# EAGLE design lifi_1 (EAGLE 8.3.0)
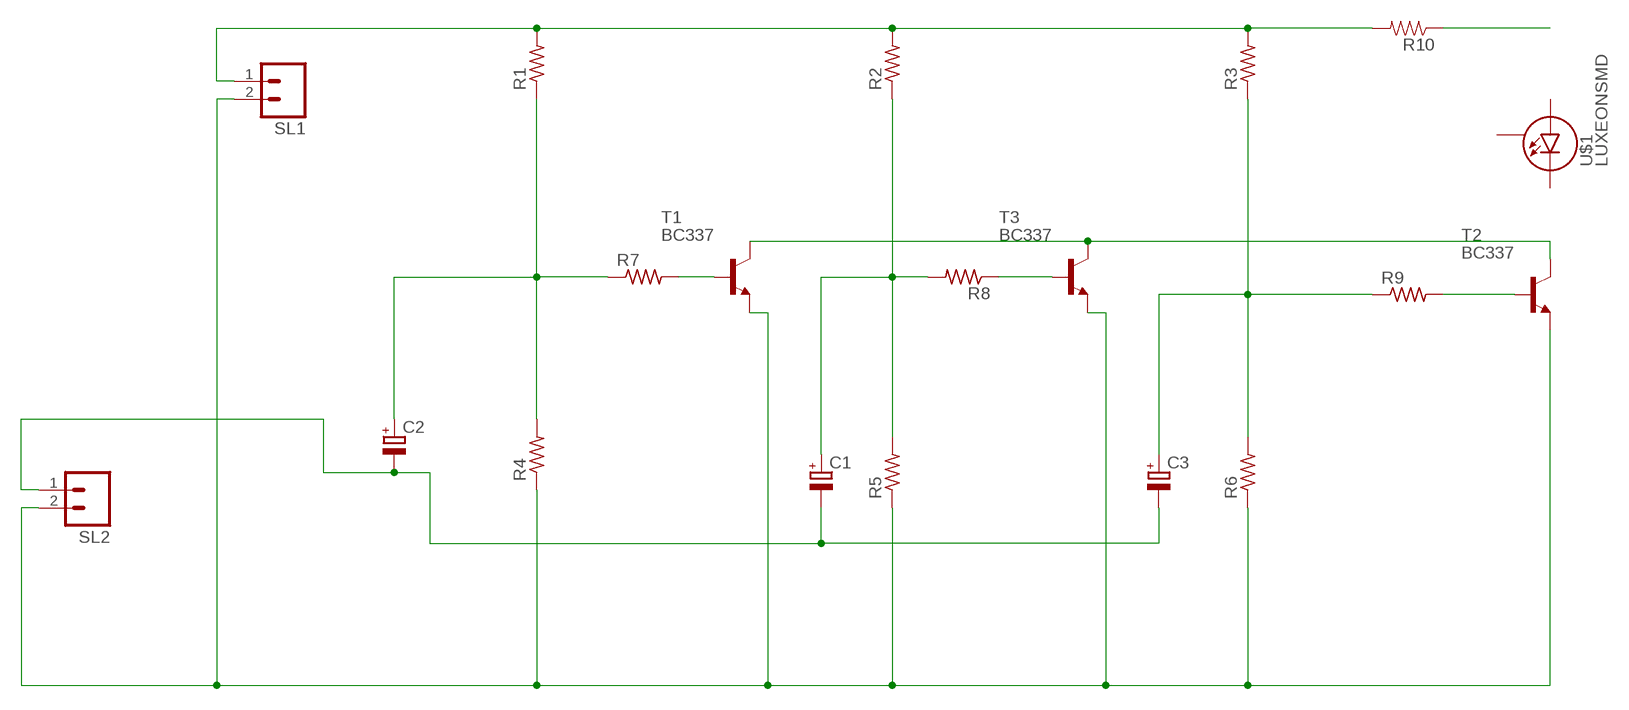
[diagram p0: schematic, sheet 1]

## Parts
C1  CPOL-EUE2,5-6E  [E2,5-6E]
C2  CPOL-EUE2,5-6E  [E2,5-6E]
C3  CPOL-EUE2,5-6E  [E2,5-6E]
R1  RESISTOR0207/7  [0207/7]
R2  RESISTOR0207/7  [0207/7]
R3  RESISTOR0207/7  [0207/7]
R4  RESISTOR0207/7  [0207/7]
R5  RESISTOR0207/7  [0207/7]
R6  RESISTOR0207/7  [0207/7]
R7  RESISTOR0207/7  [0207/7]
R8  RESISTOR0207/7  [0207/7]
R9  RESISTOR0207/7  [0207/7]
R10  RESISTORPTH-1W  [AXIAL-0.6]
SL1  M02  [02P]
SL2  M02  [02P]
T1  BC337  [TO92]
T2  BC337  [TO92]
T3  BC337  [TO92]
U$1  LUXEONSMD  [LUXEON]

## Nets
N$1: R10.P$1
N$2: R1.2 R2.2 R3.2 R10.P$2 SL1.1
N$3: C2.+ R1.1 R4.2 R7.1
N$4: R7.2 T1.2(B)
N$5: C1.+ R2.1 R5.2 R8.2
N$6: R8.1 T3.2(B)
N$9: C3.+ R3.1 R6.2 R9.1
N$11: R9.2 T2.2(B)
N$13: T1.3(C) T2.3(C) T3.3(C)
N$15: C1.- C2.- C3.- SL2.1
N$17: R4.1 R5.1 R6.1 SL1.2 SL2.2 T1.1(E) T2.1(E) T3.1(E)
Unconnected: U$1.A U$1.C U$1.S

## Library data of the parts
C1-C3 = assignment:CPOL-EU: POLARIZED CAPACITOR, European symbol
R1-R9 = CEDT_JANUARY_2015_v5:RESISTOR
R10 = SparkFun-Passives:RESISTOR: Resistor Basic schematic elements and footprints for 0603, 1206, and PTH resistors.
SL1 = CEDT_JANUARY_2015_v5:M02: AMP QUICK CONNECTOR
SL2 = con-amp-quick:M02: AMP QUICK CONNECTOR; OC_FARNELL: unknown; OC_NEWARK: unknown
T1-T3 = transistor:BC337: NPN TRANSISTOR
U$1 = SparkFun-LED:LUXEON: Luxeon LED This footprint works with the current 1 Watt, 3 Watt, and 5 Watt LEDs. These blindingly bright LEDs generate a lot of heat so the footprint has a large pad under the LED for thermal transfer. Schematic and footprint are proven. Spark Fun Electronics SKU : COM-00603

## Board
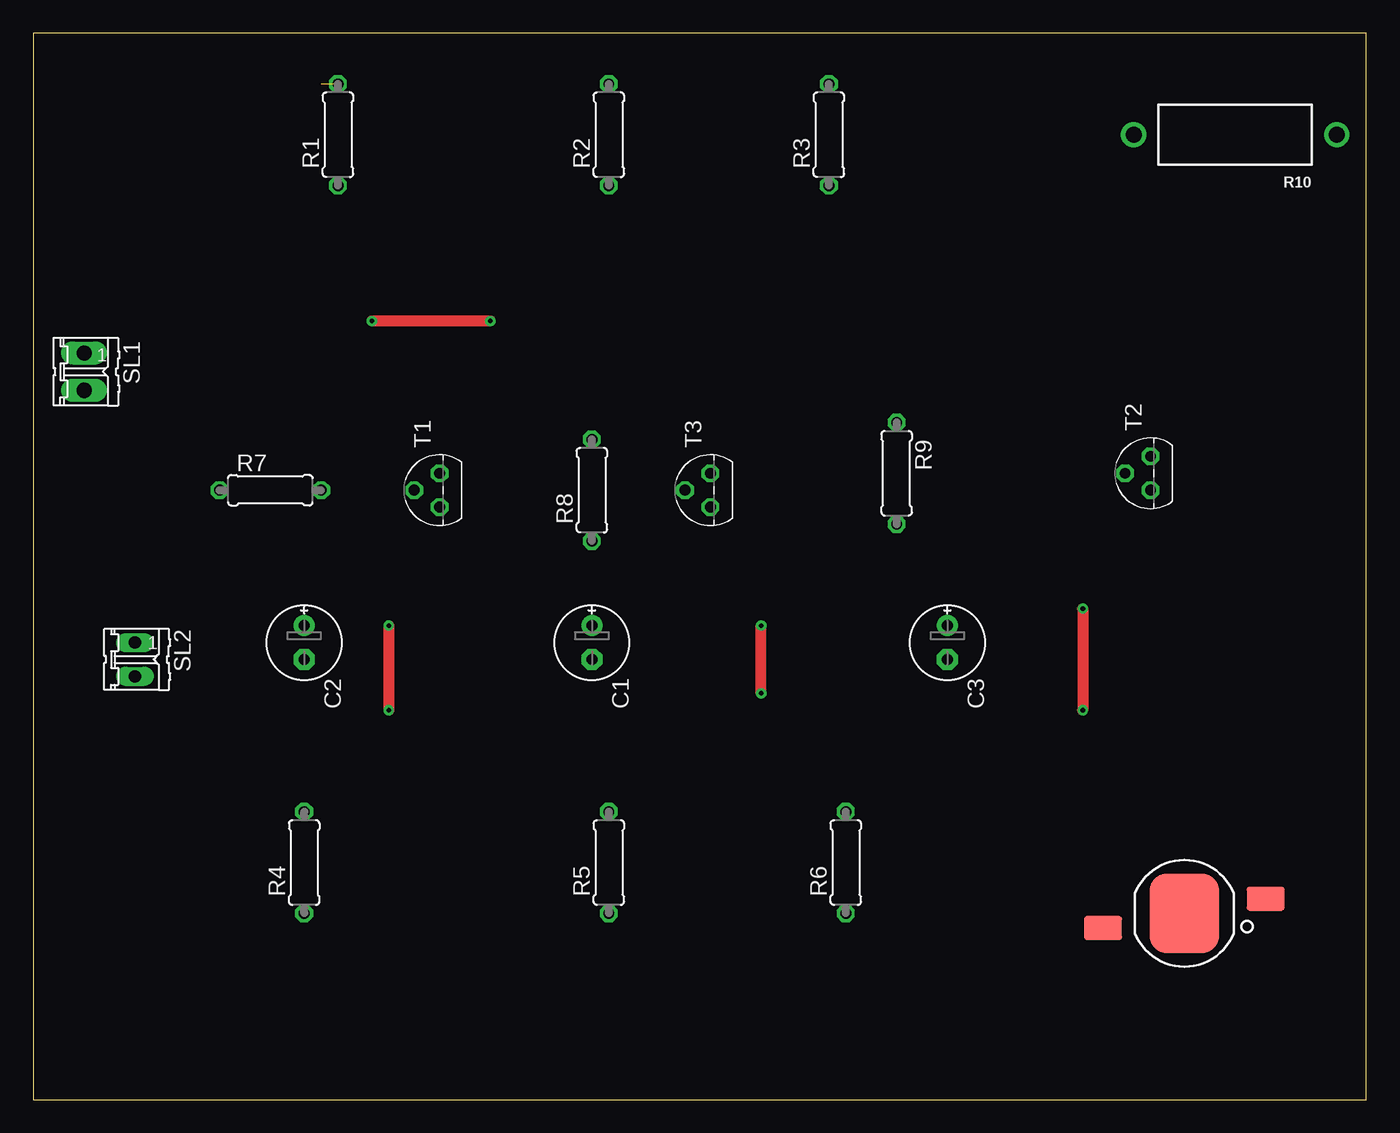
[diagram p1: board, top side]
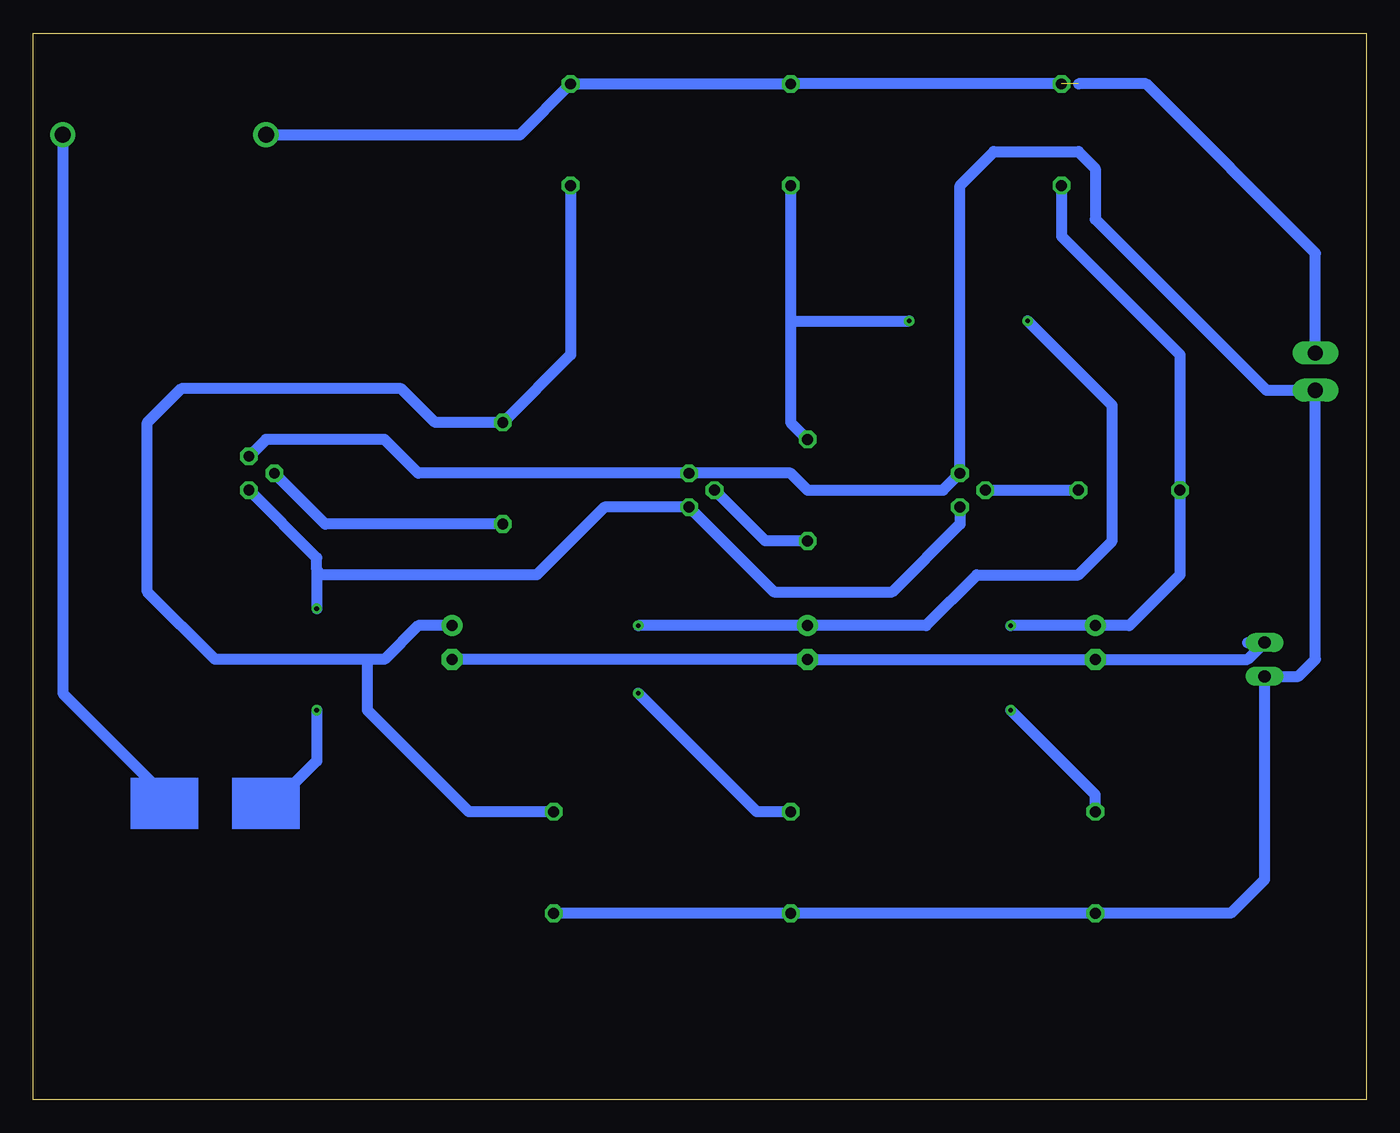
[diagram p2: board, bottom side, seen from below]

Size 100 x 80 mm. Coordinates in mm from the lower left corner, seen from the top.
Outline: 0,0 100,0 100,80 0,80 0,0
Copper layers (1*16): Top 0.035mm / dielectric 1.5mm / Bottom 0.035mm
Design rules "default": minimum track width 6mil, minimum drill 0.35mm, track to track 6mil, track to pad 6mil, pad to pad 6mil, via to via 6mil, smd to smd 6mil, copper to edge 40mil, drill to drill 6mil, minimum pad ring 10mil, minimum via ring 8mil, stop-mask expansion 4mil, vias tented up to drill 0mil, thermal gap 10mil

### Footprints (pad centres in the part's own frame; a part is rotated, then mirrored left to right if it is on the bottom)
E2,5-6E = drill 0.813 pad 1.575: + -1.27,0 | drill 0.813 pad 1.575 octagon: - 1.27,0
0207/7 = drill 0.813 octagon: 1 -3.81,0; 2 3.81,0
AXIAL-0.6 = drill 1.2 pad 1.88: P$1 -7.62,0; P$2 7.62,0
02P = drill 1.143 long: 1 -1.397,0; 2 1.397,0
02P' = drill 0.914 long: 1 -1.27,0; 2 1.27,0
TO92 = drill 0.813 octagon: 1 1.27,0; 2 0,1.905; 3 -1.27,0
LUXEON = smd 2.85 x 1.8: A -6.1,-1.1; C 6.1,1.1 | smd 5.2 x 6: S 0,0

### Placement (x,y rotation side)
C1  41.91,34.29 270 top
C2  20.32,34.29 270 top
C3  68.58,34.29 270 top
R1  22.86,72.39 90 top
R2  43.18,72.39 90 top
R3  59.69,72.39 90 top
R4  20.32,17.78 90 top
R5  43.18,17.78 90 top
R6  60.96,17.78 90 top
R7  17.78,45.72 0 top
R8  41.91,45.72 90 top
R9  64.77,46.99 270 top
R10  90.17,72.39 180 top
SL1  3.81,54.61 270 top
SL2  [02P']  7.62,33.02 270 top
T1  30.48,45.72 90 top
T2  83.82,46.99 90 top
T3  50.8,45.72 90 top
U$1  86.36,13.97 180 top

### Tracks (layer width: path | path; a pad name or v marks a point on that pad's centre or on a via)
N$1
  Bottom 0.813: R10.P$1 97.79,30.48 90.17,22.86
N$2  (1 unrouted)
  Bottom 0.813: R1.2 R2.2 R3.2 63.5,72.39 R10.P$2 | SL1.1 3.81,63.5 16.51,76.2 21.59,76.2
N$3  (via drill 0.35)
  Top 0.813: v26.67,35.56 v26.67,29.21
  Bottom 0.813: R1.1 22.86,64.77 13.97,55.88 R7.1 13.97,39.37 17.78,35.56 C2.+ v26.67,35.56 | R4.2 20.32,22.86 v26.67,29.21
N$4
  Bottom 0.813: T1.2 R7.2
N$5  (via drill 0.35)
  Top 0.813: v34.29,58.42 v25.4,58.42 | v54.61,30.48 v54.61,35.56
  Bottom 0.813: R2.1 43.18,58.42 | 43.18,58.42 43.18,50.8 R8.2 | v25.4,58.42 19.05,52.07 19.05,41.91 21.59,39.37 29.21,39.37 33.02,35.56 C1.+ v54.61,35.56 | 43.18,58.42 v34.29,58.42 | R5.2 45.72,21.59 v54.61,30.48
N$6
  Bottom 0.813: R8.1 45.09,41.91 T3.2
N$9
  Bottom 0.813: R3.1 59.69,55.88 R9.1 69.85,50.8 72.39,53.34 88.9,53.34 | 74.95,33.02 73.66,33.02 71.12,35.56 C3.+ | R6.2 67.31,21.59 74.93,29.21 74.93,33 74.95,33.02 | 88.94,53.3 91.44,50.8 91.44,38.1 86.36,33.02 74.95,33.02 | 88.94,53.3 88.9,53.34 | 88.9,53.34 88.94,53.3
N$11
  Bottom 0.813: R9.2 78.11,43.18 T2.2
N$13  (via drill 0.35)
  Top 0.813: v78.74,36.83 v78.74,29.21
  Bottom 0.813: T1.3 30.48,43.18 35.56,38.1 44.45,38.1 T3.3 57.15,44.45 62.23,39.37 78.35,39.37 78.74,39.76 | v78.74,29.21 78.74,25.4 81.28,22.86 82.55,22.86 | T2.3 78.74,40.64 78.74,39.76 | 78.74,39.76 v78.74,36.83
N$15
  Bottom 0.813: C3.- C1.- C2.- 8.89,33.02 SL2.1 8.89,34.29
N$17
  Bottom 0.813: 4.17,53.34 5.08,53.34 | 4.17,53.34 3.94,53.34 SL1.2 7.49,53.21 20.32,66.04 20.32,69.85 21.59,71.12 27.94,71.12 30.48,68.58 T1.1 31.75,45.72 41.91,45.72 43.18,46.99 T3.1 71.12,46.99 73.66,49.53 82.55,49.53 T2.1 83.77,48.21 | 4.17,53.34 3.81,52.98 3.81,33.02 5.08,31.75 SL2.2 7.62,16.51 10.16,13.97 R4.1 R5.1 R6.1
(copper drawn outside any net)
  shapes: Bottom area x2, Top area x2